# Altium schematic sheet PushButtonside.SchDoc
size B; DocumentNumber: 5; SheetNumber: 5; SheetTotal: 6
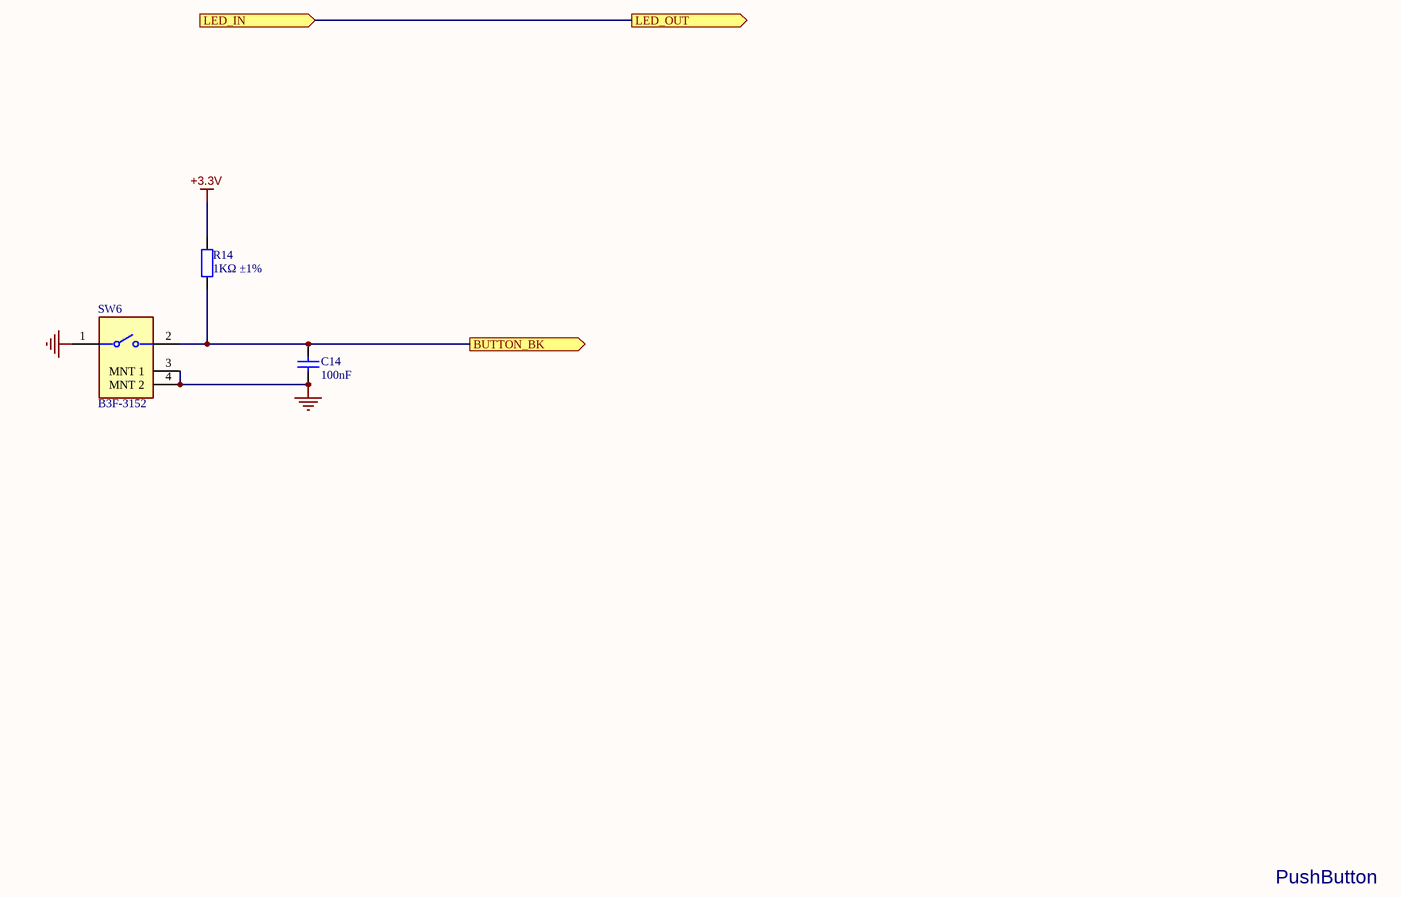
[diagram p0: PushButtonside.SchDoc]

## Parts
C14  100nF  [0603_C]
R14  1KΩ ±1%  [0603_R]
SW6  B3F-3152  [FP-B3F-3152-MFG]

## Ports
BUTTON_BK (out), LED_IN (in), LED_OUT (out)

## Nets
+3.3V: R14.1
GND: C14.2 SW6.1 SW6.3(MNT_1) SW6.4(MNT_2)
BUTTON_BK: C14.1 R14.2 SW6.2 ; port BUTTON_BK
LED_IN: port LED_OUT, port LED_IN

## Notes on the sheet
- PushButton
- SHEET
- Expatria Technologies
- 1136 Glade Court
- Port Coquitlam, BC V3B 1R5
- PROJECT
- SIZE
- ENGR
- MODIFIED
- DOCUMENT
- REV
- Copyright Expatria Technologies 2021.  This document describes Open Hardware and is licensed under the CERN-OHL-P  v2.  No warranty is implied or expressed.
- EMAIL: INFO@EXPATRIA.CA
- B
- /

## Library data of the parts
C14 = 0603 100nF (104) 10% 50V: Chip capacitors; Manufacturer: YAGEO; PartNumber: CC0603KRX7R9BB104; Tolerance: 10%; Voltage: 50V; ComponentLink1Description: Supplier link; ComponentLink1URL: http://www.szlcsc.com/product/details_15331.html; Package: 0603; Supplier: LC; SuppliersPartNumber: C14663; Capacitance: 100nF
R14 = 0603 1K (1001) 1%: Chip resistor; Manufacturer: Uniroyal Elec; PartNumber: 0603WAF1001T5E; Power: 1/10W; ComponentLink1Description: Supplier link; ComponentLink1URL: http://www.szlcsc.com/product/details_21904.html; Package: 0603; Supplier: LC; SuppliersPartNumber: C21190; Resistance: 1KΩ; Tolerance: 1%
SW6 = CMP-08834-000033-1: SWITCH TACTILE SPST-NO 0.05A 24V; SuppliersPartNumber: C145896